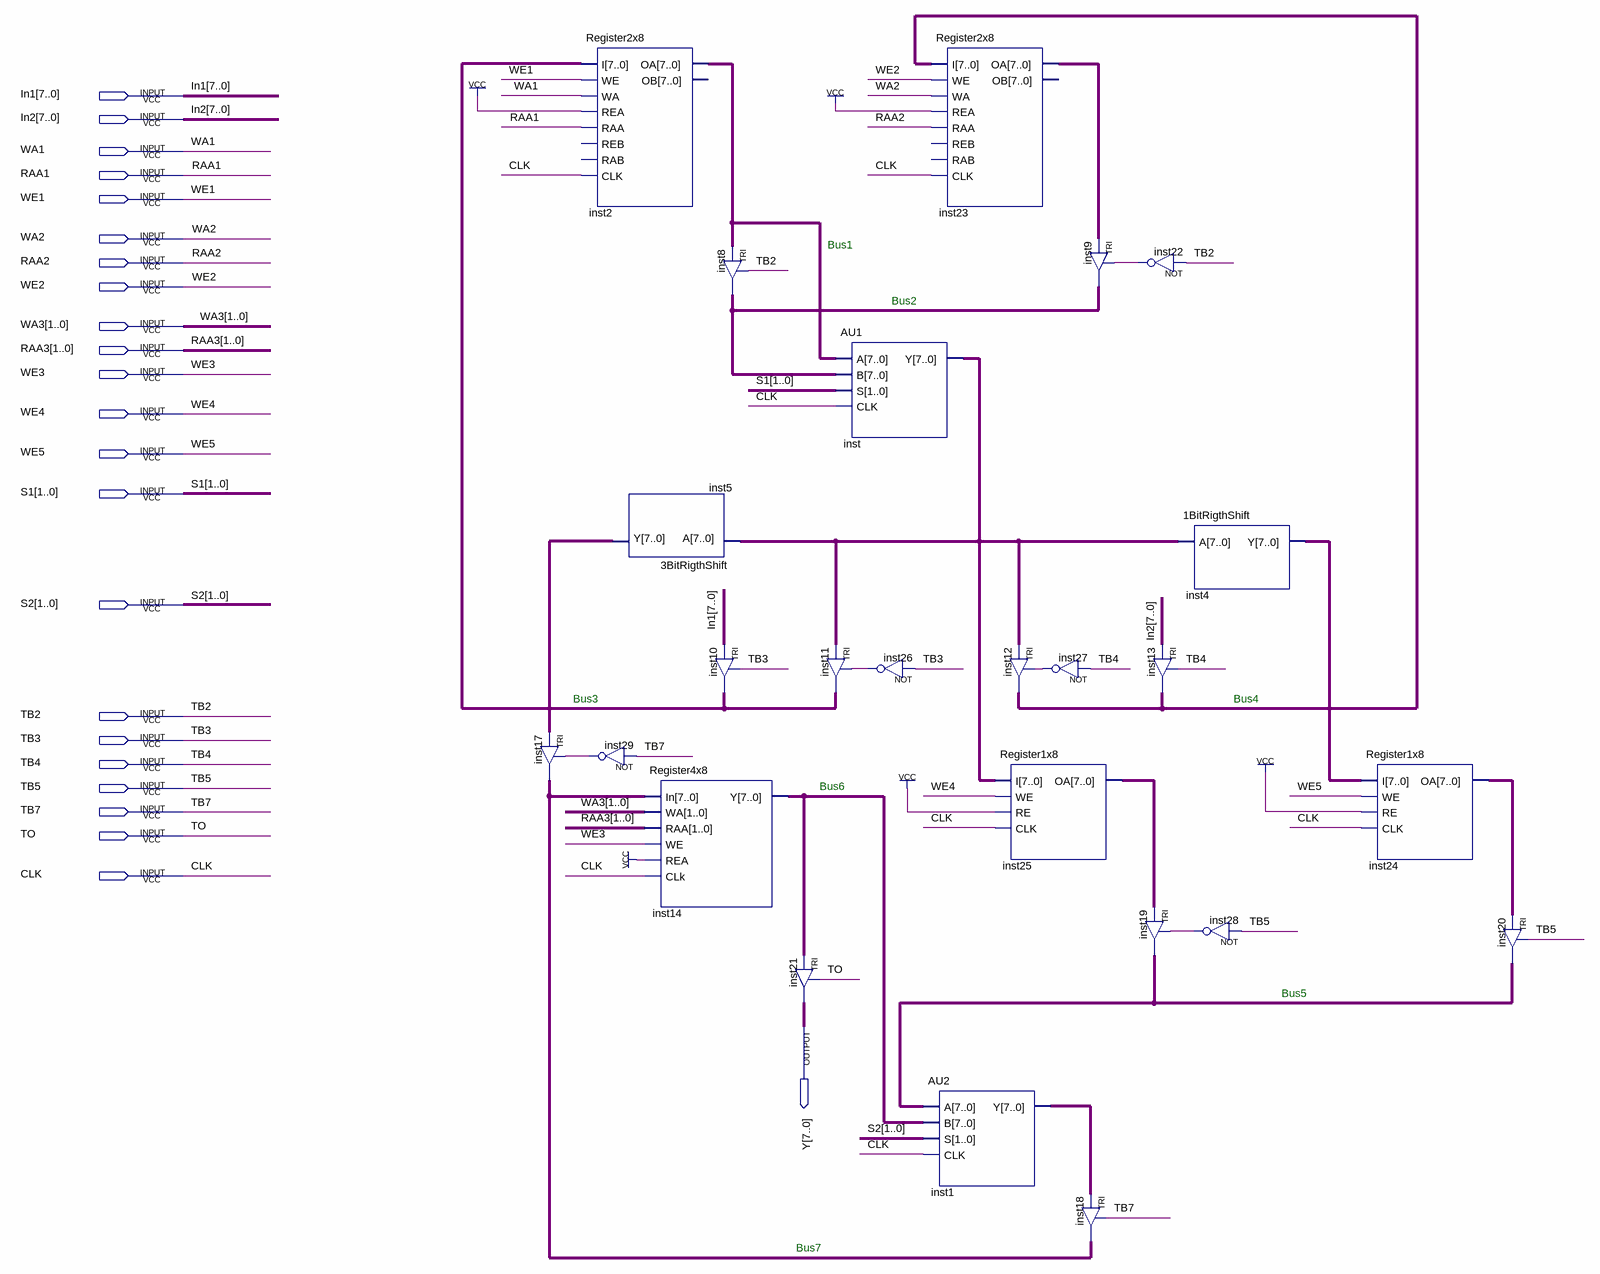
[diagram p0: schematic sheet]
// Quartus schematic Datapath.bdf as structural Verilog: 25 symbols, 23 pins
module Datapath (
  input  [7:0] In1,
  input  [7:0] In2,
  input  WA1,
  input  RAA1,
  input  WE1,
  input  WA2,
  input  RAA2,
  input  WE2,
  input  [1:0] WA3,
  input  [1:0] RAA3,
  input  WE3,
  input  WE4,
  input  WE5,
  input  [1:0] S1,
  input  [1:0] S2,
  input  TB2,
  input  TB3,
  input  TB4,
  input  TB5,
  input  TB7,
  input  TO,
  input  CLK,
  output [7:0] Y
);

  wire inst22_out, inst26_out, inst27_out, inst28_out, inst29_out;
  wire [7:0] inst1_y, inst2_oa, inst4_y, inst5_y, inst8_out, inst10_out, inst12_out, inst14_y, inst17_out,
       inst19_out, inst23_oa, inst24_oa, inst25_oa, inst_y;

  TRI inst17[7:0] (.IN(inst5_y), .OE(inst29_out), .OUT(inst17_out));
  Register2x8 inst2 (
    .I(inst10_out), .WE(WE1), .WA(WA1), .REA(1'b1), .RAA(RAA1), .CLK(CLK), .OA(inst2_oa));  // open: REB, RAB, OB
  \3BitRigthShift  inst5 (.A(inst_y), .Y(inst5_y));
  not inst29 (inst29_out, TB7);
  Register4x8 inst14 (.In(inst17_out), .WA(WA3), .RAA(RAA3), .WE(WE3), .REA(1'b1), .CLk(CLK), .Y(inst14_y));
  TRI inst8[7:0] (.IN(inst2_oa), .OE(TB2), .OUT(inst8_out));
  TRI inst10[7:0] (.IN(In1), .OE(TB3), .OUT(inst10_out));
  TRI inst21[7:0] (.IN(inst14_y), .OE(TO), .OUT(Y));
  AU1 inst (.A(inst2_oa), .B(inst8_out), .S(S1), .CLK(CLK), .Y(inst_y));
  TRI inst11[7:0] (.IN(inst_y), .OE(inst26_out), .OUT(inst10_out));
  not inst26 (inst26_out, TB3);
  Register2x8 inst23 (
    .I(inst12_out), .WE(WE2), .WA(WA2), .REA(1'b1), .RAA(RAA2), .CLK(CLK), .OA(inst23_oa));  // open: REB, RAB, OB
  AU2 inst1 (.A(inst19_out), .B(inst14_y), .S(S2), .CLK(CLK), .Y(inst1_y));
  TRI inst12[7:0] (.IN(inst_y), .OE(inst27_out), .OUT(inst12_out));
  Register1x8 inst25 (.I(inst_y), .WE(WE4), .RE(1'b1), .CLK(CLK), .OA(inst25_oa));
  not inst27 (inst27_out, TB4);
  TRI inst9[7:0] (.IN(inst23_oa), .OE(inst22_out), .OUT(inst8_out));
  TRI inst18[7:0] (.IN(inst1_y), .OE(TB7), .OUT(inst17_out));
  not inst22 (inst22_out, TB2);
  \1BitRigthShift  inst4 (.A(inst_y), .Y(inst4_y));
  TRI inst13[7:0] (.IN(In2), .OE(TB4), .OUT(inst12_out));
  TRI inst19[7:0] (.IN(inst25_oa), .OE(inst28_out), .OUT(inst19_out));
  not inst28 (inst28_out, TB5);
  Register1x8 inst24 (.I(inst4_y), .WE(WE5), .RE(1'b1), .CLK(CLK), .OA(inst24_oa));
  TRI inst20[7:0] (.IN(inst24_oa), .OE(TB5), .OUT(inst19_out));

  // Notes on the sheet:
  //   Bus1
  //   Bus2
  //   Bus3
  //   Bus4
  //   Bus6
  //   Bus5
  //   Bus7
endmodule
